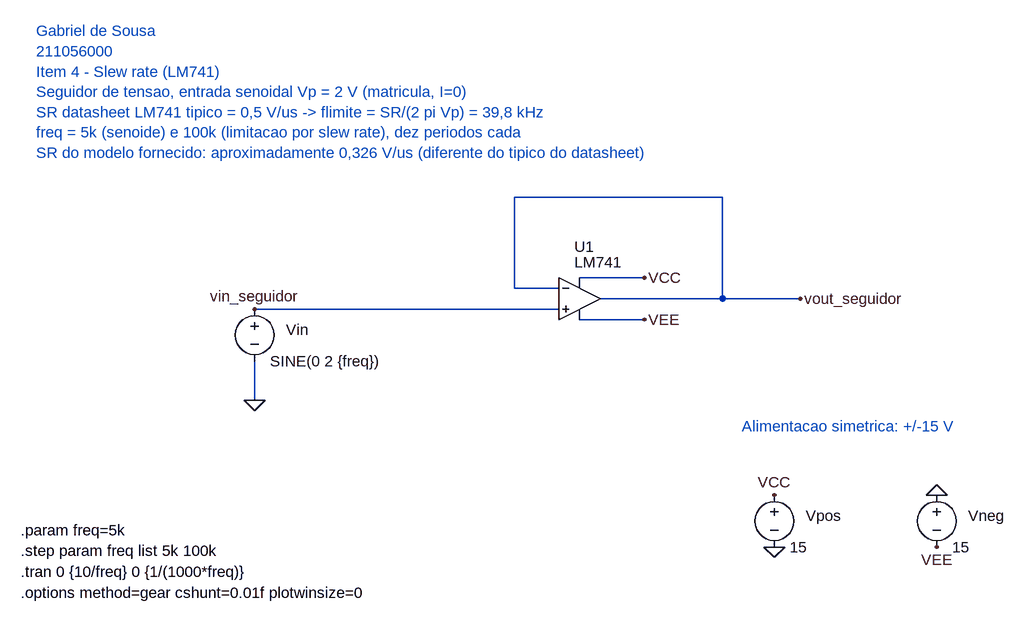
[diagram p0: schematic item_4.asc]
item_4.asc, the LTspice schematic file:
Version 4.1
SHEET 1 1600 900
TEXT 64 -48 Left 2 ;Gabriel de Sousa\n211056000\nItem 4 - Slew rate (LM741)\nSeguidor de tensao, entrada senoidal Vp = 2 V (matricula, I=0)\nSR datasheet LM741 tipico = 0,5 V/us -> flimite = SR/(2 pi Vp) = 39,8 kHz\nfreq = 5k (senoide) e 100k (limitacao por slew rate), dez periodos cada\nSR do modelo fornecido: aproximadamente 0,326 V/us (diferente do tipico do datasheet)
SYMBOL LM741 900 300 R0
WINDOW 0 -8 -16 Left 2
WINDOW 3 -8 8 Left 2
SYMATTR InstName U1
WIRE 900 332 1000 332
FLAG 1000 332 VCC
WIRE 900 396 1000 396
FLAG 1000 396 VEE
WIRE 932 364 1240 364
WIRE 1120 364 1120 208
WIRE 1120 208 800 208
WIRE 800 208 800 348
WIRE 800 348 868 348
WIRE 400 380 868 380
WIRE 400 460 400 520
SYMBOL voltage 400 364 R0
WINDOW 0 48 48 Left 2
SYMATTR InstName Vin
SYMATTR Value SINE(0 2 {freq})
FLAG 400 380 vin_seguidor
FLAG 400 520 0
FLAG 1240 364 vout_seguidor
TEXT 1150 560 Left 2 ;Alimentacao simetrica: +/-15 V
SYMBOL voltage 1200 650 R0
WINDOW 0 48 48 Left 2
SYMATTR InstName Vpos
SYMATTR Value 15
SYMBOL voltage 1450 650 R0
WINDOW 0 48 48 Left 2
SYMATTR InstName Vneg
SYMATTR Value 15
FLAG 1200 666 VCC
FLAG 1200 746 0
FLAG 1450 666 0
FLAG 1450 746 VEE
TEXT 40 720 Left 2 !.param freq=5k
TEXT 40 752 Left 2 !.step param freq list 5k 100k
TEXT 40 784 Left 2 !.tran 0 {10/freq} 0 {1/(1000*freq)}
TEXT 40 816 Left 2 !.options method=gear cshunt=0.01f plotwinsize=0

The netlist it stands for:
* item_4.asc
X§U1 vin_seguidor vout_seguidor VCC VEE vout_seguidor LM741  ; pins In+ In- V+ V- OUT
Vin vin_seguidor 0 SINE(0 2 {freq})
Vpos VCC 0 15
Vneg 0 VEE 15
* Gabriel de Sousa
* 211056000
* Item 4 - Slew rate (LM741)
* Seguidor de tensao, entrada senoidal Vp = 2 V (matricula, I=0)
* SR datasheet LM741 tipico = 0,5 V/us -> flimite = SR/(2 pi Vp) = 39,8 kHz
* freq = 5k (senoide) e 100k (limitacao por slew rate), dez periodos cada
* SR do modelo fornecido: aproximadamente 0,326 V/us (diferente do tipico do datasheet)
* Alimentacao simetrica: +/-15 V
.param freq=5k
.step param freq list 5k 100k
.tran 0 {10/freq} 0 {1/(1000*freq)}
.options method=gear cshunt=0.01f plotwinsize=0
.lib LM741.lib
.backanno
.end